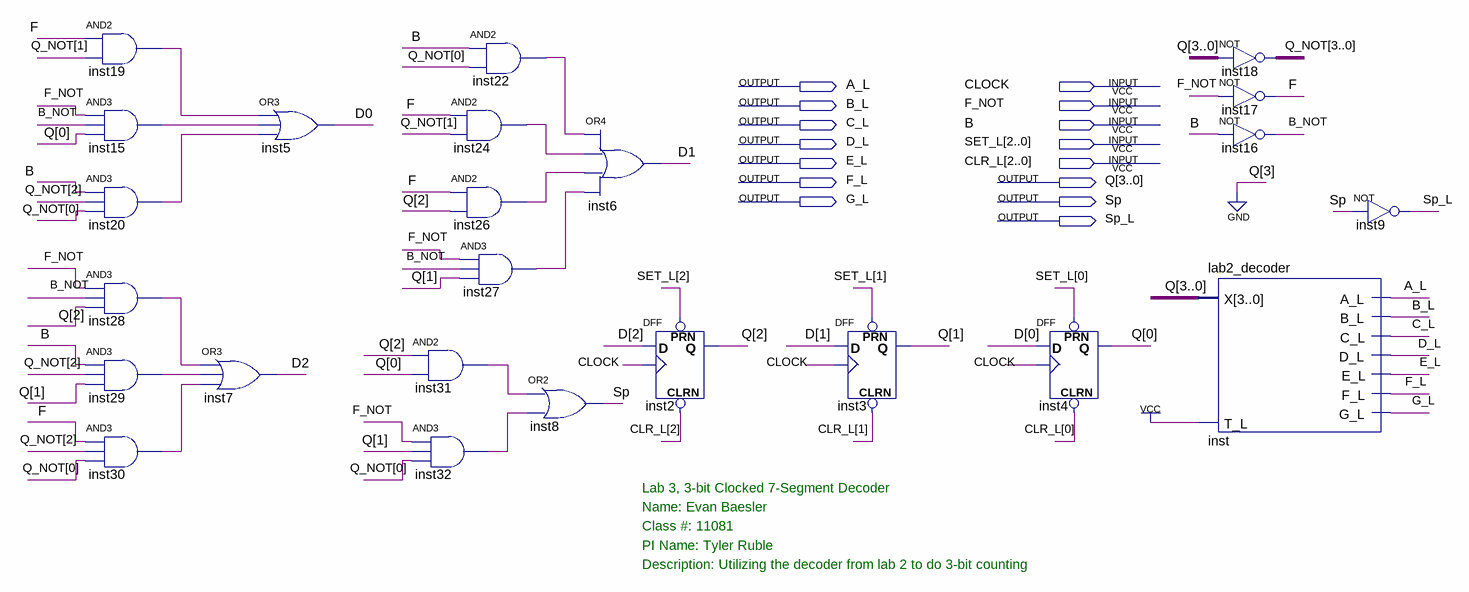
[diagram p0: schematic sheet]
// Quartus schematic lab3_3bit_cnt.bdf as structural Verilog: 24 symbols, 15 pins
module lab3_3bit_cnt (
  input  CLOCK,
  input  F_NOT,
  input  B,
  input  [2:0] SET_L,
  input  [2:0] CLR_L,
  output A_L,
  output B_L,
  output C_L,
  output D_L,
  output E_L,
  output F_L,
  output [3:0] Q,
  output G_L,
  output Sp,
  output Sp_L
);

  wire B_NOT, F, inst15_out, inst19_out, inst20_out, inst22_out, inst24_out, inst26_out, inst27_out,
       inst28_out, inst29_out, inst30_out, inst31_out, inst32_out;
  wire [2:0] D;
  wire [3:0] Q_NOT;

  and inst19 (inst19_out, F, Q_NOT[1]);
  and inst15 (inst15_out, F_NOT, B_NOT, Q[0]);
  and inst20 (inst20_out, B, Q_NOT[2], Q_NOT[0]);
  and inst28 (inst28_out, F_NOT, B_NOT, Q[2]);
  and inst29 (inst29_out, B, Q_NOT[2], Q[1]);
  and inst30 (inst30_out, F, Q_NOT[2], Q_NOT[0]);
  or inst7 (D[2], inst28_out, inst29_out, inst30_out);
  or inst5 (D[0], inst19_out, inst15_out, inst20_out);
  and inst31 (inst31_out, Q[2], Q[0]);
  and inst32 (inst32_out, F_NOT, Q[1], Q_NOT[0]);
  and inst22 (inst22_out, B, Q_NOT[0]);
  and inst24 (inst24_out, F, Q_NOT[1]);
  and inst26 (inst26_out, F, Q[2]);
  and inst27 (inst27_out, F_NOT, B_NOT, Q[1]);
  or inst6 (D[1], inst22_out, inst24_out, inst26_out, inst27_out);
  or inst8 (Sp, inst31_out, inst32_out);
  DFF inst2 (.CLRN(CLR_L[2]), .CLK(CLOCK), .D(D[2]), .PRN(SET_L[2]), .Q(Q[2]));
  DFF inst3 (.CLRN(CLR_L[1]), .CLK(CLOCK), .D(D[1]), .PRN(SET_L[1]), .Q(Q[1]));
  DFF inst4 (.CLRN(CLR_L[0]), .CLK(CLOCK), .D(D[0]), .PRN(SET_L[0]), .Q(Q[0]));
  lab2_decoder inst (
    .X({1'b0, Q[2:0]}), .T_L(1'b1), .C_L(C_L), .D_L(D_L), .A_L(A_L), .E_L(E_L), .B_L(B_L), .F_L(F_L),
    .G_L(G_L));
  assign Q_NOT = ~{1'b0, Q[2:0]};  // NOT inst18, 4 bits wide
  not inst17 (F, F_NOT);
  not inst16 (B_NOT, B);
  not inst9 (Sp_L, Sp);

  assign Q[3] = 1'b0;

  // Notes on the sheet:
  //   Lab 3, 3-bit Clocked 7-Segment Decoder
  //   Name: Evan Baesler
  //   Class #: 11081
  //   PI Name: Tyler Ruble
  //   Description: Utilizing the decoder from lab 2 to do 3-bit counting
endmodule
